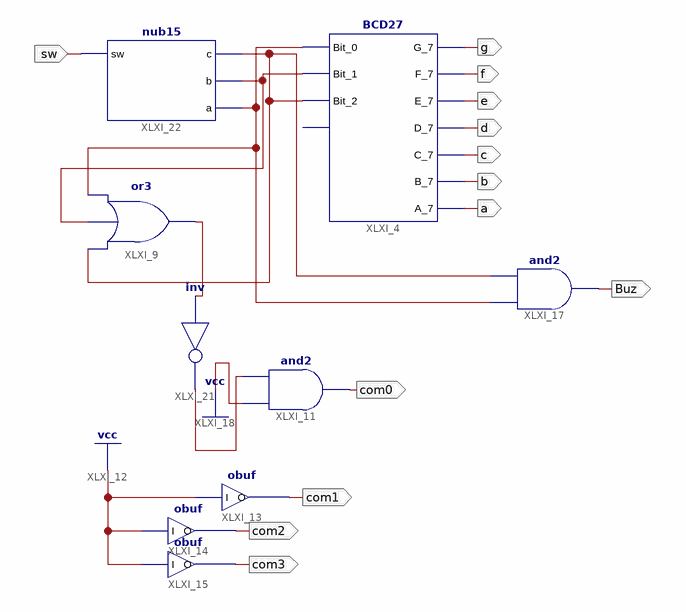
[diagram p0: schematic sheet 1]
// Xilinx ISE schematic nub04.sch (spartan6) as structural Verilog: 9 symbols, 13 ports
module nub04 (
  input  sw,
  output g,
  output f,
  output e,
  output d,
  output c,
  output b,
  output a,
  output com2,
  output com1,
  output com3,
  output Buz,
  output com0
);

  wire XLXN_8, XLXN_9, XLXN_10, XLXN_33, XLXN_34;

  BCD27 XLXI_4 (
    .A_7(a), .Bit_0(XLXN_10), .Bit_1(XLXN_9), .Bit_2(XLXN_8), .B_7(b), .C_7(c), .D_7(d), .E_7(e), .F_7(f),
    .G_7(g));  // open: Bit_3
  or XLXI_9 (XLXN_33, XLXN_8, XLXN_9, XLXN_10);
  obuf XLXI_13 (.I(1'b1), .O(com1));
  obuf XLXI_14 (.I(1'b1), .O(com2));
  obuf XLXI_15 (.I(1'b1), .O(com3));
  and XLXI_17 (Buz, XLXN_10, XLXN_8);
  and XLXI_11 (com0, 1'b1, XLXN_34);
  not XLXI_21 (XLXN_34, XLXN_33);
  nub15 XLXI_22 (.a(XLXN_10), .b(XLXN_9), .c(XLXN_8), .sw(sw));
endmodule
